# Altium schematic sheet 001_OverViewDevKIT.SchDoc: OverView BAS DevKIT
size A2; Organization: Greenfield Tech Solutions; Address1: Molendreef 33; Address2: Ossendrecht; Address3: 4641CS; Address4: The Netherlands; SheetNumber: 1; SheetTotal: 8
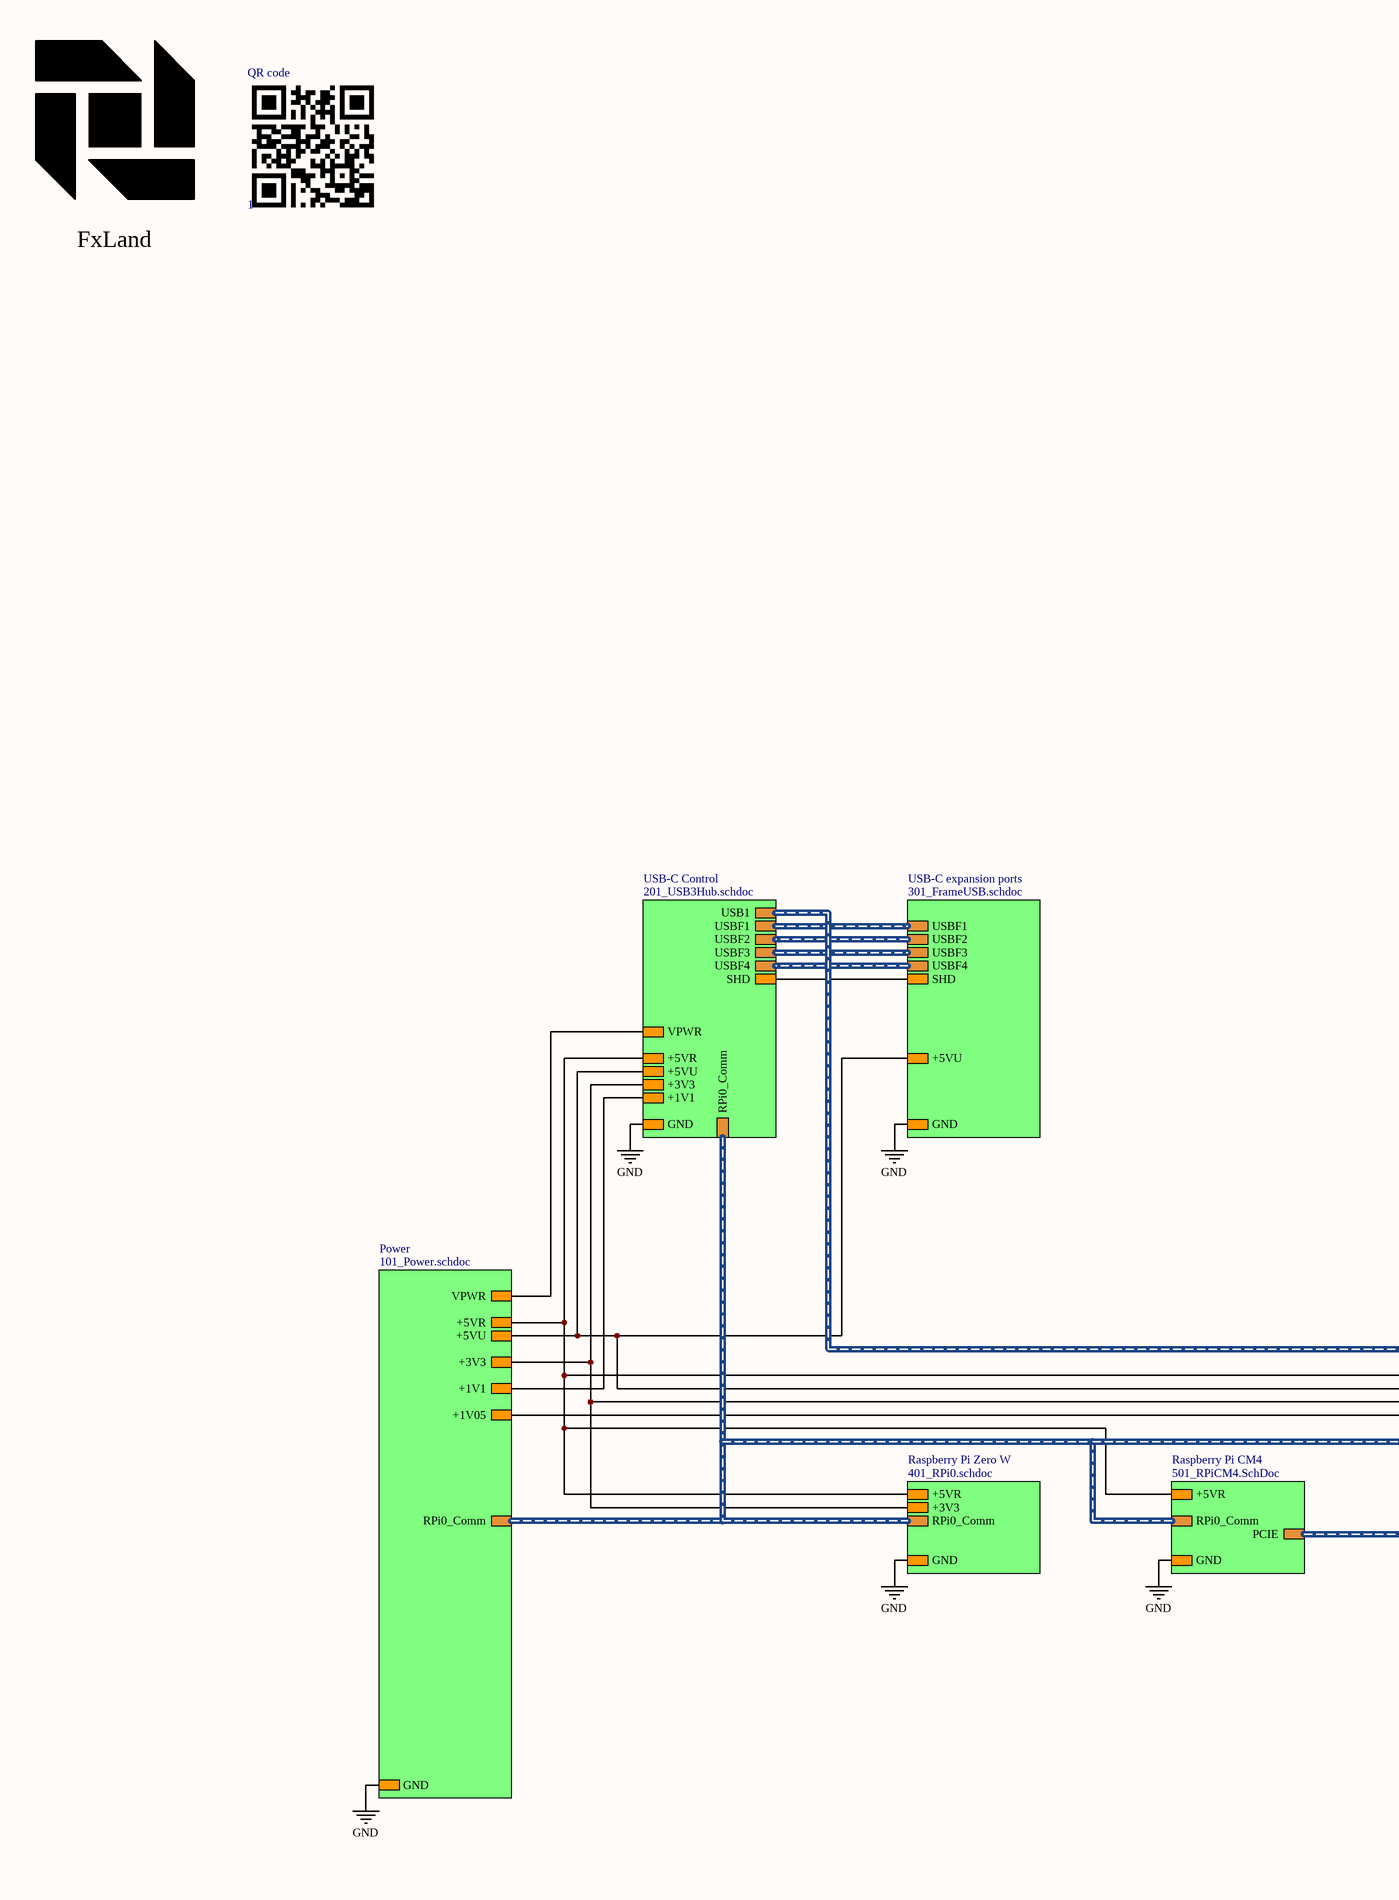
[diagram p0: 001_OverViewDevKIT.SchDoc, left]
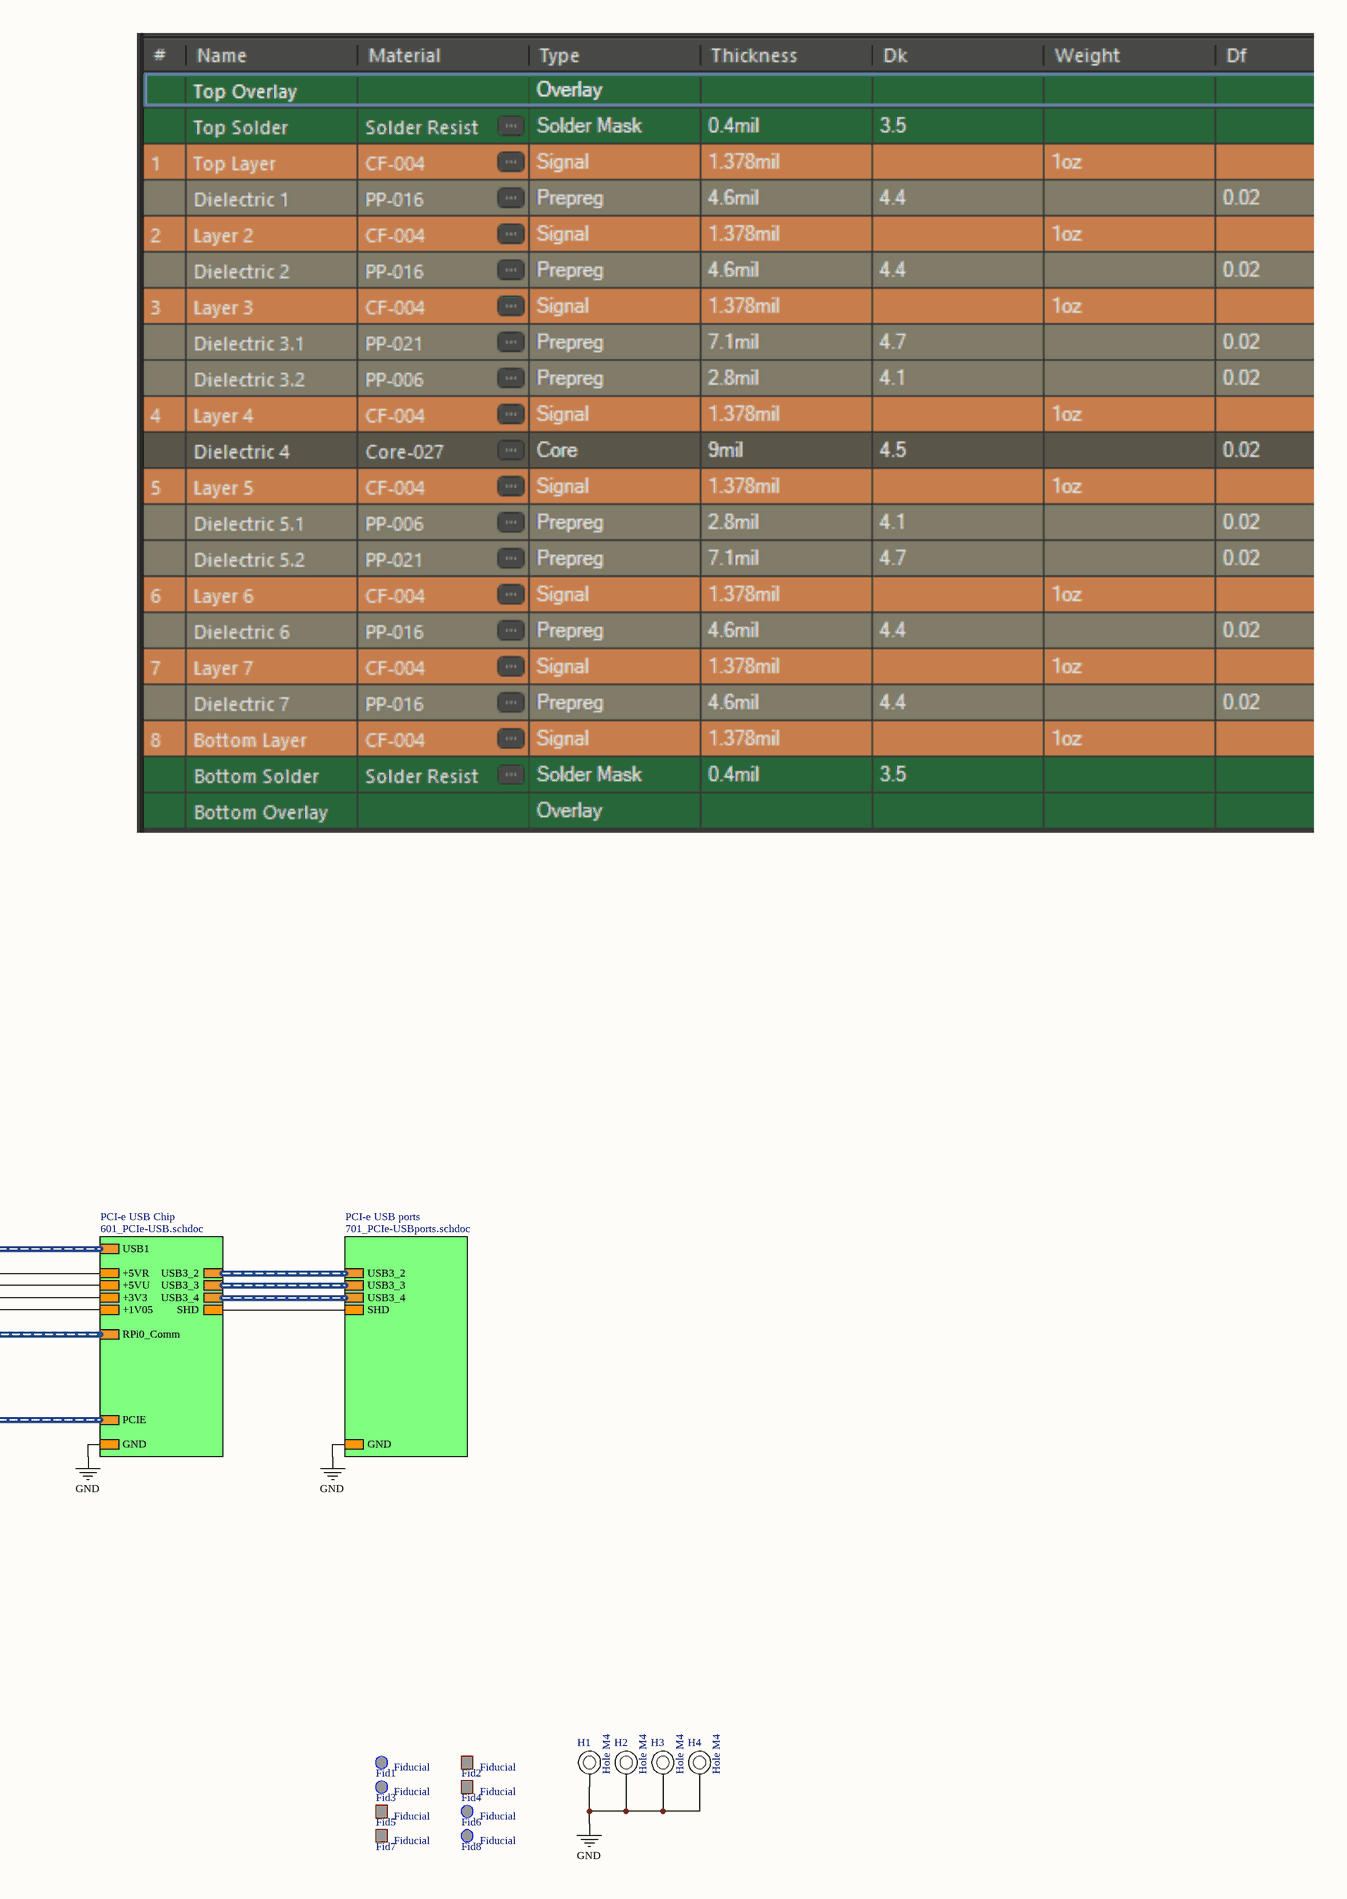
[diagram p1: 001_OverViewDevKIT.SchDoc, right]

## Parts
1  QR code  [QR_FXLAND_1]
Fid1  Fiducial  [FidR_1.0mm]
Fid2  Fiducial  [FidS_1.0mm]
Fid3  Fiducial  [FidR_1.0mm]
Fid4  Fiducial  [FidS_1.0mm]
Fid5  Fiducial  [FidS_1.0mm]
Fid6  Fiducial  [FidR_1.0mm]
Fid7  Fiducial  [FidS_1.0mm]
Fid8  Fiducial  [FidR_1.0mm]
H1  Hole M4  [HOLE_M4]
H2  Hole M4  [HOLE_M4]
H3  Hole M4  [HOLE_M4]
H4  Hole M4  [HOLE_M4]
Logo_FxLand1  FxLand  [Logo_FxLand_3]  (value not drawn)

## Sub-sheets
PCI-e USB Chip = 601_PCIe-USB.schdoc: GND, SHD, PCIE (harness HF0), USB1 (harness HF0), +1V05, +3V3, USB3_2 (harness HF1), USB3_3 (harness HF2), USB3_4 (harness HF2), +5VR, +5VU, RPi0_Comm (harness CU1)
PCI-e USB ports = 701_PCIe-USBports.schdoc: GND, SHD, USB3_2 (harness HF1), USB3_3 (harness HF2), USB3_4 (harness HF2)
Power = 101_Power.schdoc: GND, VPWR, +3V3, +1V05, +5VR, RPi0_Comm (harness CU1), +5VU, +1V1
Raspberry Pi CM4 = 501_RPiCM4.SchDoc: GND, +5VR, PCIE (harness HF0), RPi0_Comm (harness CU1)
Raspberry Pi Zero W = 401_RPi0.schdoc: GND, +5VR, +3V3, RPi0_Comm (harness CU1)
USB-C Control = 201_USB3Hub.schdoc: GND, VPWR, +5VR, +3V3, +1V1, SHD, RPi0_Comm (harness CU1), USBF2 (harness HF0), USBF3 (harness HF1), USBF4 (harness HF2), USB1 (harness HF0), USBF1 (harness HF0), +5VU
USB-C expansion ports = 301_FrameUSB.schdoc: GND, +5VU, SHD, USBF2 (harness HF0), USBF3 (harness HF1), USBF4 (harness HF2), USBF1 (harness HF0)

## Nets
GND: H1.1 H2.1 H3.1 H4.1 ; sheet Power/GND, sheet USB-C expansion ports/GND, sheet Raspberry Pi Zero W/GND, sheet Raspberry Pi CM4/GND, sheet USB-C Control/GND, sheet PCI-e USB Chip/GND, sheet PCI-e USB ports/GND
(unnamed): sheet Power/VPWR, sheet USB-C Control/VPWR
(unnamed): sheet Power/+3V3, sheet Raspberry Pi Zero W/+3V3, sheet USB-C Control/+3V3, sheet PCI-e USB Chip/+3V3
(unnamed): sheet Power/+1V05, sheet PCI-e USB Chip/+1V05
(unnamed): sheet Power/+5VR, sheet Raspberry Pi Zero W/+5VR, sheet Raspberry Pi CM4/+5VR, sheet USB-C Control/+5VR, sheet PCI-e USB Chip/+5VR
(unnamed): sheet Power/+5VU, sheet USB-C expansion ports/+5VU, sheet USB-C Control/+5VU, sheet PCI-e USB Chip/+5VU
(unnamed): sheet Power/+1V1, sheet USB-C Control/+1V1
(unnamed): sheet USB-C expansion ports/SHD, sheet USB-C Control/SHD
(unnamed): sheet PCI-e USB Chip/SHD, sheet PCI-e USB ports/SHD

## Buses and harness runs
harness sheet PCI-e USB Chip/PCIE = sheet Raspberry Pi CM4/PCIE
harness sheet PCI-e USB Chip/RPi0_Comm = sheet Power/RPi0_Comm = sheet Raspberry Pi CM4/RPi0_Comm = sheet Raspberry Pi Zero W/RPi0_Comm = sheet USB-C Control/RPi0_Comm
harness sheet PCI-e USB Chip/USB1 = sheet USB-C Control/USB1
harness sheet PCI-e USB Chip/USB3_2 = sheet PCI-e USB ports/USB3_2
harness sheet PCI-e USB Chip/USB3_3 = sheet PCI-e USB ports/USB3_3
harness sheet PCI-e USB Chip/USB3_4 = sheet PCI-e USB ports/USB3_4
harness sheet USB-C Control/USBF1 = sheet USB-C expansion ports/USBF1
harness sheet USB-C Control/USBF2 = sheet USB-C expansion ports/USBF2
harness sheet USB-C Control/USBF3 = sheet USB-C expansion ports/USBF3
harness sheet USB-C Control/USBF4 = sheet USB-C expansion ports/USBF4

## Notes on the sheet
- Title
- Size:
- Date:
- File:
- A2
- Number:
- Time:
- Revision:
- Sheet
- of

## Library data of the parts
1 = ME0023: QR code FxLand 1; Part Number: ME0023; ID: 23; RefVal: QR code
Fid1 Fid3 Fid6 Fid8 = ME0011: Fiducial Round 1mm; Part Number: ME0011; ID: 11; RefVal: Fiducial
Fid2 Fid4 Fid5 Fid7 = ME0012: Fiducial Sqaure 1mm; Part Number: ME0012; ID: 12; RefVal: Fiducial
H1-H4 = ME0002: Mounting Hole M4; Part Number: ME0002; ID: 2; RefVal: Hole M4
Logo_FxLand1 = ME0008: Logo FxLand 3; Part Number: ME0008; ID: 8; RefVal: FxLand